# EAGLE schematic axiom_beta_plugin_module_1xHDMI_v0.2.5435a560 (EAGLE 7.0.0)
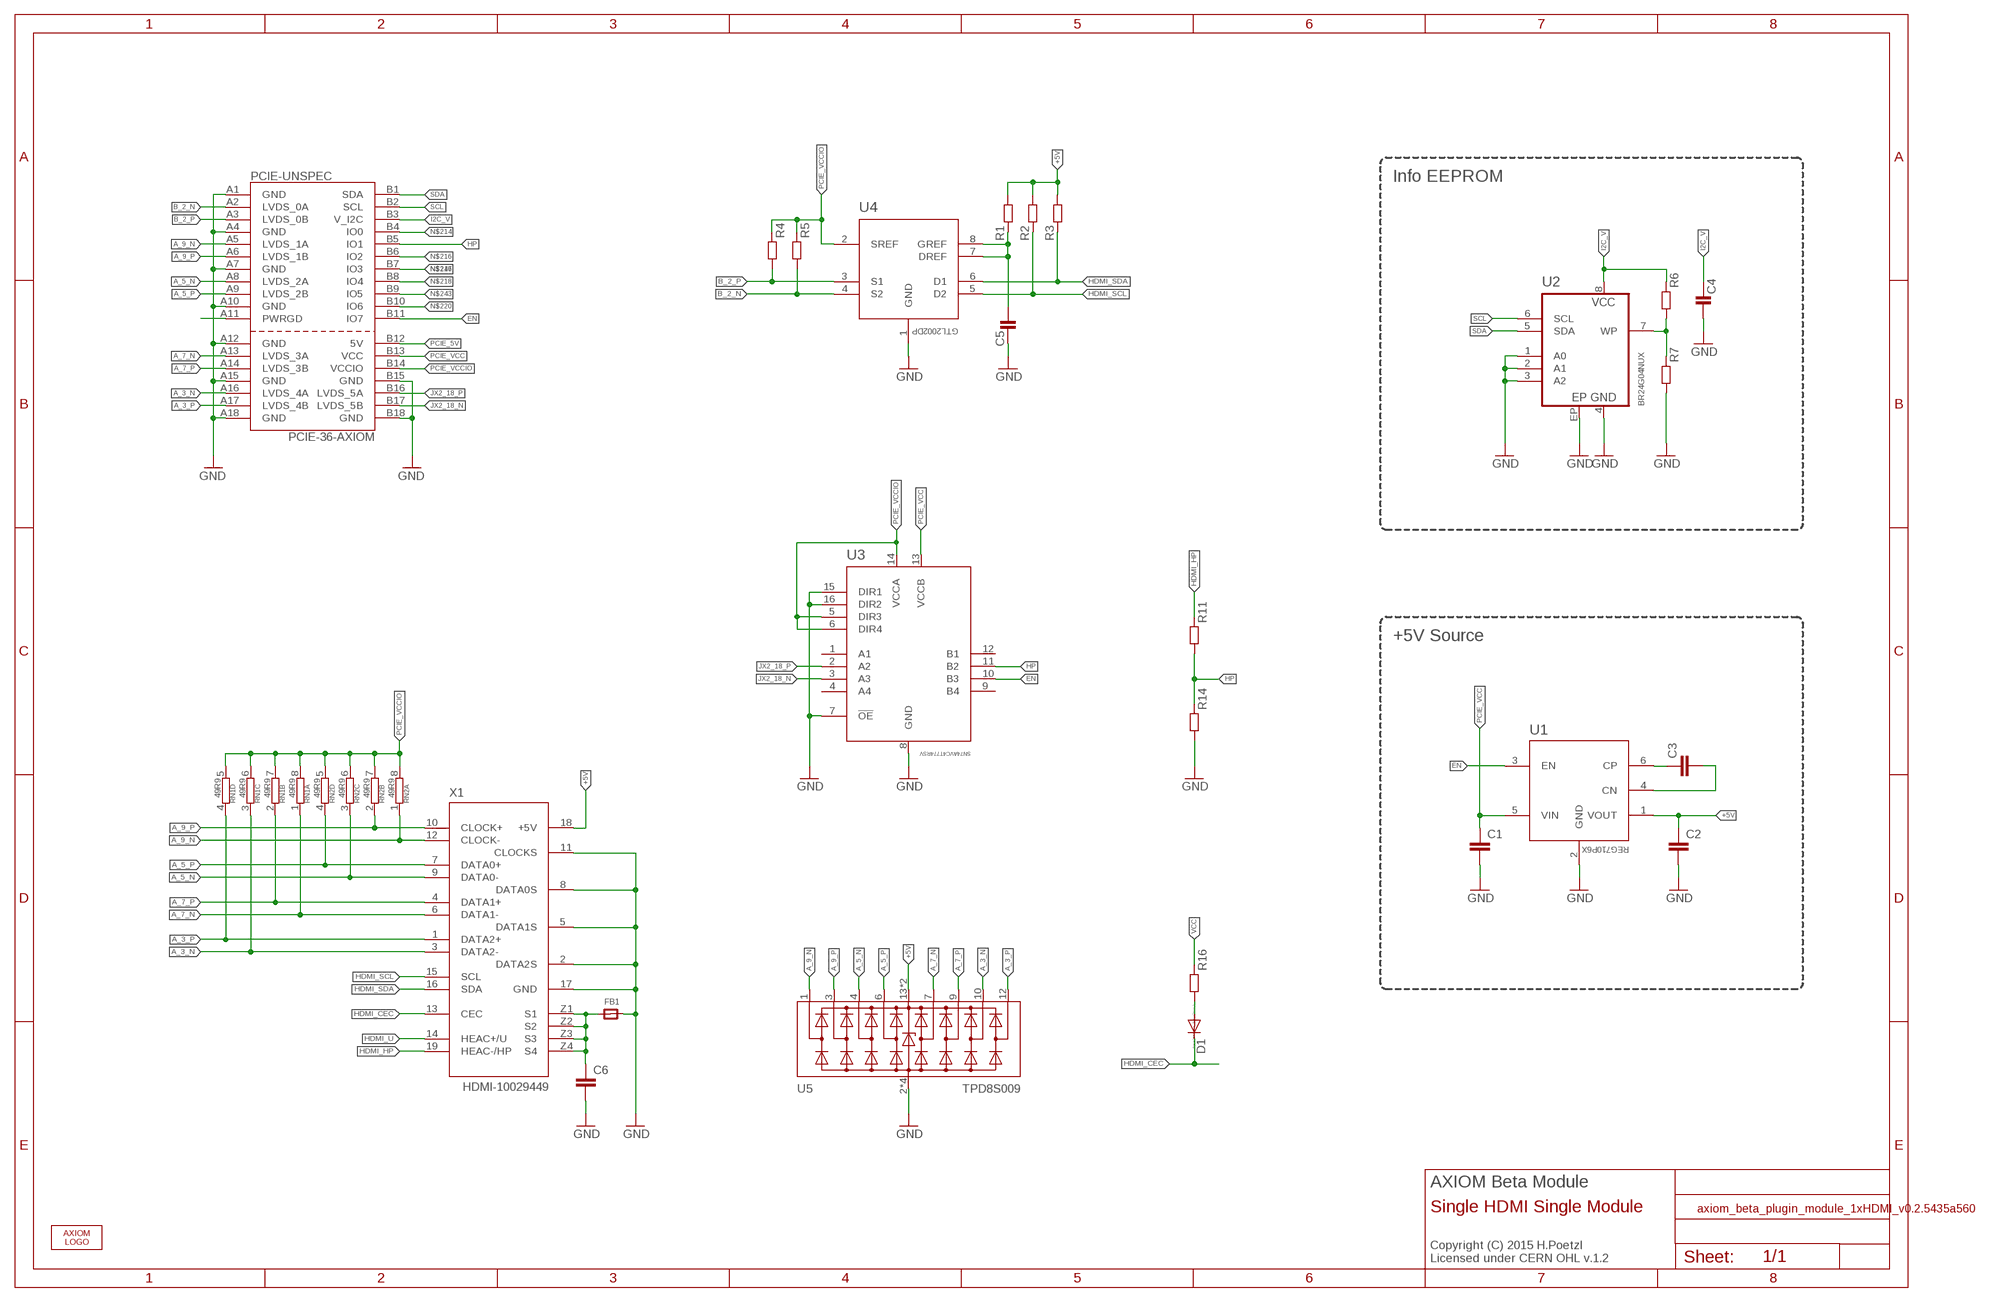
[diagram p0: schematic, sheet 1]

## Parts
C1  C-EUC0603K  [C0603K]
C2  C-EUC0603K  [C0603K]
C3  C-EUC0603K  [C0603K]
C4  C0402-B  [0402-B]
C5  C0402-B  [0402-B]
C6  C-EUC0603K  [C0603K]
D1  DIODE-SOD523  [SOD523]
FB1  FERRITE_0603MP  [_0603MP]
PCIE-UNSPEC  PCIE-36-AXIOM  [PCIE-36-AXIOM]
R1  R0402-B  [0402-B]
R2  R0402-B  [0402-B]
R3  R0402-B  [0402-B]
R4  R0402-B  [0402-B]
R5  R0402-B  [0402-B]
R6  R0402-B  [0402-B]
R7  R0603-B  [0603-B]
R11  R0402-B  [0402-B]
R14  R0402-B  [0402-B]
R16  R0402-B  [0402-B]
RN1  49R9  4R-NCAY16  [CAY16]
RN2  49R9  4R-NCAY16  [CAY16]
U1  REG710P6X  [SOT65P210X110-6N]
U2  BR24G04NUX  [DFN200X300X100-9N]
U3  SN74AVC4T774RSV  [QFN40P185X265X55-16N]
U4  GTL2002DP  [TSSOP-8]
U5  TPD8S009  [R-PDSO-N15]
U$1  AXIOM_LOGO262X40  [AXIOM_LOGO_262X40]
X1  HDMI-10029449  [10029449-X01XLF]

## Nets
+5V: C2.1 R1.2 R2.2 R3.2 U1.1(VOUT) U5.13(VCC) U5.15(VCC) X1.18(+5V)
A_3_N [power]: PCIE-UNSPEC.A16(LVDS_4A) RN1.3 U5.10(ESD7) X1.3(DATA2-)
A_3_P [power]: PCIE-UNSPEC.A17(LVDS_4B) RN1.4 U5.12(ESD8) X1.1(DATA2+)
A_5_N [power]: PCIE-UNSPEC.A8(LVDS_2A) RN2.3 U5.4(ESD3) X1.9(DATA0-)
A_5_P [power]: PCIE-UNSPEC.A9(LVDS_2B) RN2.4 U5.6(ESD4) X1.7(DATA0+)
A_7_N [power]: PCIE-UNSPEC.A13(LVDS_3A) RN1.1 U5.7(ESD5) X1.6(DATA1-)
A_7_P [power]: PCIE-UNSPEC.A14(LVDS_3B) RN1.2 U5.9(ESD6) X1.4(DATA1+)
A_9_N [power]: PCIE-UNSPEC.A5(LVDS_1A) RN2.1 U5.1(ESD1) X1.12(CLOCK-)
A_9_P [power]: PCIE-UNSPEC.A6(LVDS_1B) RN2.2 U5.3(ESD2) X1.10(CLOCK+)
B_2_N: PCIE-UNSPEC.A2(LVDS_0A) R5.2 U4.4(S2)
B_2_P: PCIE-UNSPEC.A3(LVDS_0B) R4.2 U4.3(S1)
EN: PCIE-UNSPEC.B11(IO7) U1.3(EN) U3.10(B3)
GND: C1.2 C2.2 C4.2 C5.1 C6.2 FB1.2 PCIE-UNSPEC.A1(GND) PCIE-UNSPEC.A4(GND) PCIE-UNSPEC.A7(GND) PCIE-UNSPEC.A10(GND) PCIE-UNSPEC.A12(GND) PCIE-UNSPEC.A15(GND) PCIE-UNSPEC.A18(GND) PCIE-UNSPEC.B15(GND) PCIE-UNSPEC.B18(GND) R7.2 R14.2 U1.2(GND) U2.1(A0) U2.2(A1) U2.3(A2) U2.4(GND) U2.EP U3.7(!OE) U3.8(GND) U3.15(DIR1) U3.16(DIR2) U4.1(GND) U5.2(GND) U5.5(GND) U5.8(GND) U5.11(GND) X1.2(DATA2S) X1.5(DATA1S) X1.8(DATA0S) X1.11(CLOCKS) X1.17(GND)
HDMI_CEC: D1.C X1.13(CEC)
HDMI_HP: R11.1 X1.19(HEAC-/HP)
HDMI_SCL: R2.1 U4.5(D2) X1.15(SCL)
HDMI_SDA: R3.1 U4.6(D1) X1.16(SDA)
HDMI_U: X1.14(HEAC+/U)
HP: PCIE-UNSPEC.B5(IO1) R11.2 R14.1 U3.11(B2)
I2C_V: C4.1 PCIE-UNSPEC.B3(V_I2C) R6.1 U2.8(VCC)
JX2_18_N [power]: PCIE-UNSPEC.B17(LVDS_5B) U3.3(A3)
JX2_18_P [power]: PCIE-UNSPEC.B16(LVDS_5A) U3.2(A2)
N$1: C3.1 U1.6(CP)
N$5: C3.2 U1.4(CN)
N$12: R6.2 R7.1 U2.7(WP)
N$15: C6.1 FB1.1 X1.Z1(S1) X1.Z2(S2) X1.Z3(S3) X1.Z4(S4)
N$18: D1.A R16.2
N$45: C5.2 R1.1 U4.7(DREF) U4.8(GREF)
N$209: PCIE-UNSPEC.A11(PWRGD)
N$214: PCIE-UNSPEC.B4(IO0)
N$216: PCIE-UNSPEC.B6(IO2)
N$218: PCIE-UNSPEC.B8(IO4)
N$220: PCIE-UNSPEC.B10(IO6)
N$243: PCIE-UNSPEC.B9(IO5)
N$247: PCIE-UNSPEC.B7(IO3)
PCIE_5V: PCIE-UNSPEC.B12(5V)
PCIE_VCC: C1.1 PCIE-UNSPEC.B13(VCC) U1.5(VIN) U3.13(VCCB)
PCIE_VCCIO: PCIE-UNSPEC.B14(VCCIO) R4.1 R5.1 RN1.5 RN1.6 RN1.7 RN1.8 RN2.5 RN2.6 RN2.7 RN2.8 U3.5(DIR3) U3.6(DIR4) U3.14(VCCA) U4.2(SREF)
SCL: PCIE-UNSPEC.B2(SCL) U2.6(SCL)
SDA: PCIE-UNSPEC.B1(SDA) U2.5(SDA)
VCC: R16.1
Unconnected: U3.1(A1) U3.4(A4) U3.9(B4) U3.12(B1)

## Notes on the sheet
- Info EEPROM
- +5V Source
- AXIOM Beta Module
- Single HDMI Single Module
- Copyright (C) 2015 H.Poetzl
  Licensed under CERN OHL v.1.2

## Library data of the parts
C1-C3 C6 = rcl:C-EU: CAPACITOR, European symbol
C4 C5 = generic-rcl:C
D1 = diode:DIODE-: DIODE
FB1 = microbuilder:FERRITE: Ferrite Bead 0603 MMZ1608B121C - 120 Ohm @ 100MHz, 600mA, 0.15 Ohm DC Resistance - Digikey: 445-2164-1-ND BK1608HW121-T - 120 Ohm, 600mA Ferrite Chip - Digikey: 587-1876-2-ND 0805 HZ0805B272R-10 - 2.7K Ohm @ 100MHz, 200mA, 0.8 Ohm DC Resistance - Digikey: 240-2504-1-ND (see also Murata BLM21BD272SN1L) MMZ2012Y152B - 1.5K Ohm @ 100MHz, 500mA, 0.4 Ohm DC Resistance - Digikey: 445-1560-1-ND - Mainly for high frequency (80-400MHz) MMZ2012R102A - 1K Ohm @ 100MHz, 500mA, 0.3 Ohm DC Resistance - Digikey: 445-1555-2-ND - More general purpose (10-200MHz)
PCIE-UNSPEC = PCIe:PCIE-36-AXIOM
R1-R7 R11 R14 R16 = generic-rcl:R
RN1 RN2 = resistor-dil:4R-N: Array Chip Resistor Source: RS Component / Phycomp; OC_FARNELL: unknown; OC_NEWARK: unknown
U1 = reg710:REG710: Buck/Boost Charge Pump 60mA
U2 = eeprom:BR24G04
U3 = lvltrans:SN74AVC4T774: 4-BIT DUAL-SUPPLY BUS TRANSCEIVER
U4 = gtl2002:GTL2002: Bidirectional low voltage translator,SOIC-8
U5 = esd:TPD8S009
U$1 = logos_apertus_axiom:AXIOM_LOGO
X1 = hdmi:HDMI

## Net classes
0 default: width 0.152 mm, drill 0.254 mm
1 power: width 0.152 mm, drill 0.254 mm